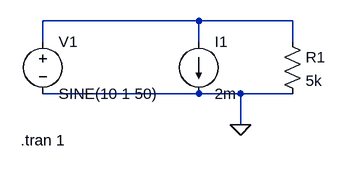
[diagram p0: schematic Q5.asc]
Q5.asc, the LTspice schematic file:
Version 4
SHEET 1 880 680
WIRE 192 64 -48 64
WIRE 336 64 192 64
WIRE -48 96 -48 64
WIRE 192 96 192 64
WIRE 336 96 336 64
WIRE 192 176 -48 176
WIRE 256 176 192 176
WIRE 336 176 256 176
WIRE 256 224 256 176
FLAG 256 224 0
SYMBOL voltage -48 80 R0
WINDOW 123 0 0 Left 0
WINDOW 39 0 0 Left 0
SYMATTR InstName V1
SYMATTR Value SINE(10 1 50)
SYMBOL current 192 96 R0
WINDOW 123 0 0 Left 0
WINDOW 39 0 0 Left 0
SYMATTR InstName I1
SYMATTR Value 2m
SYMBOL res 320 80 R0
SYMATTR InstName R1
SYMATTR Value 5k
TEXT -82 248 Left 2 !.tran 1

The netlist it stands for:
* Q5.asc
V1 N001 0 SINE(10 1 50)
I1 N001 0 2m
R1 N001 0 5k
.tran 1
.backanno
.end